# Altium schematic sheet Power_Reg.SchDoc
size B
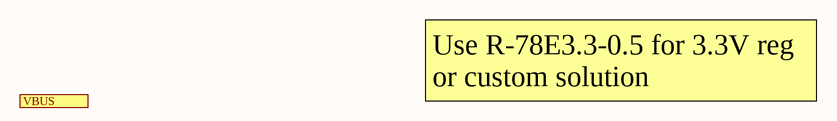
[diagram p0: Power_Reg.SchDoc]

## Ports
VBUS (in)

## Notes on the sheet
- Use R-78E3.3-0.5 for 3.3V reg or custom solution